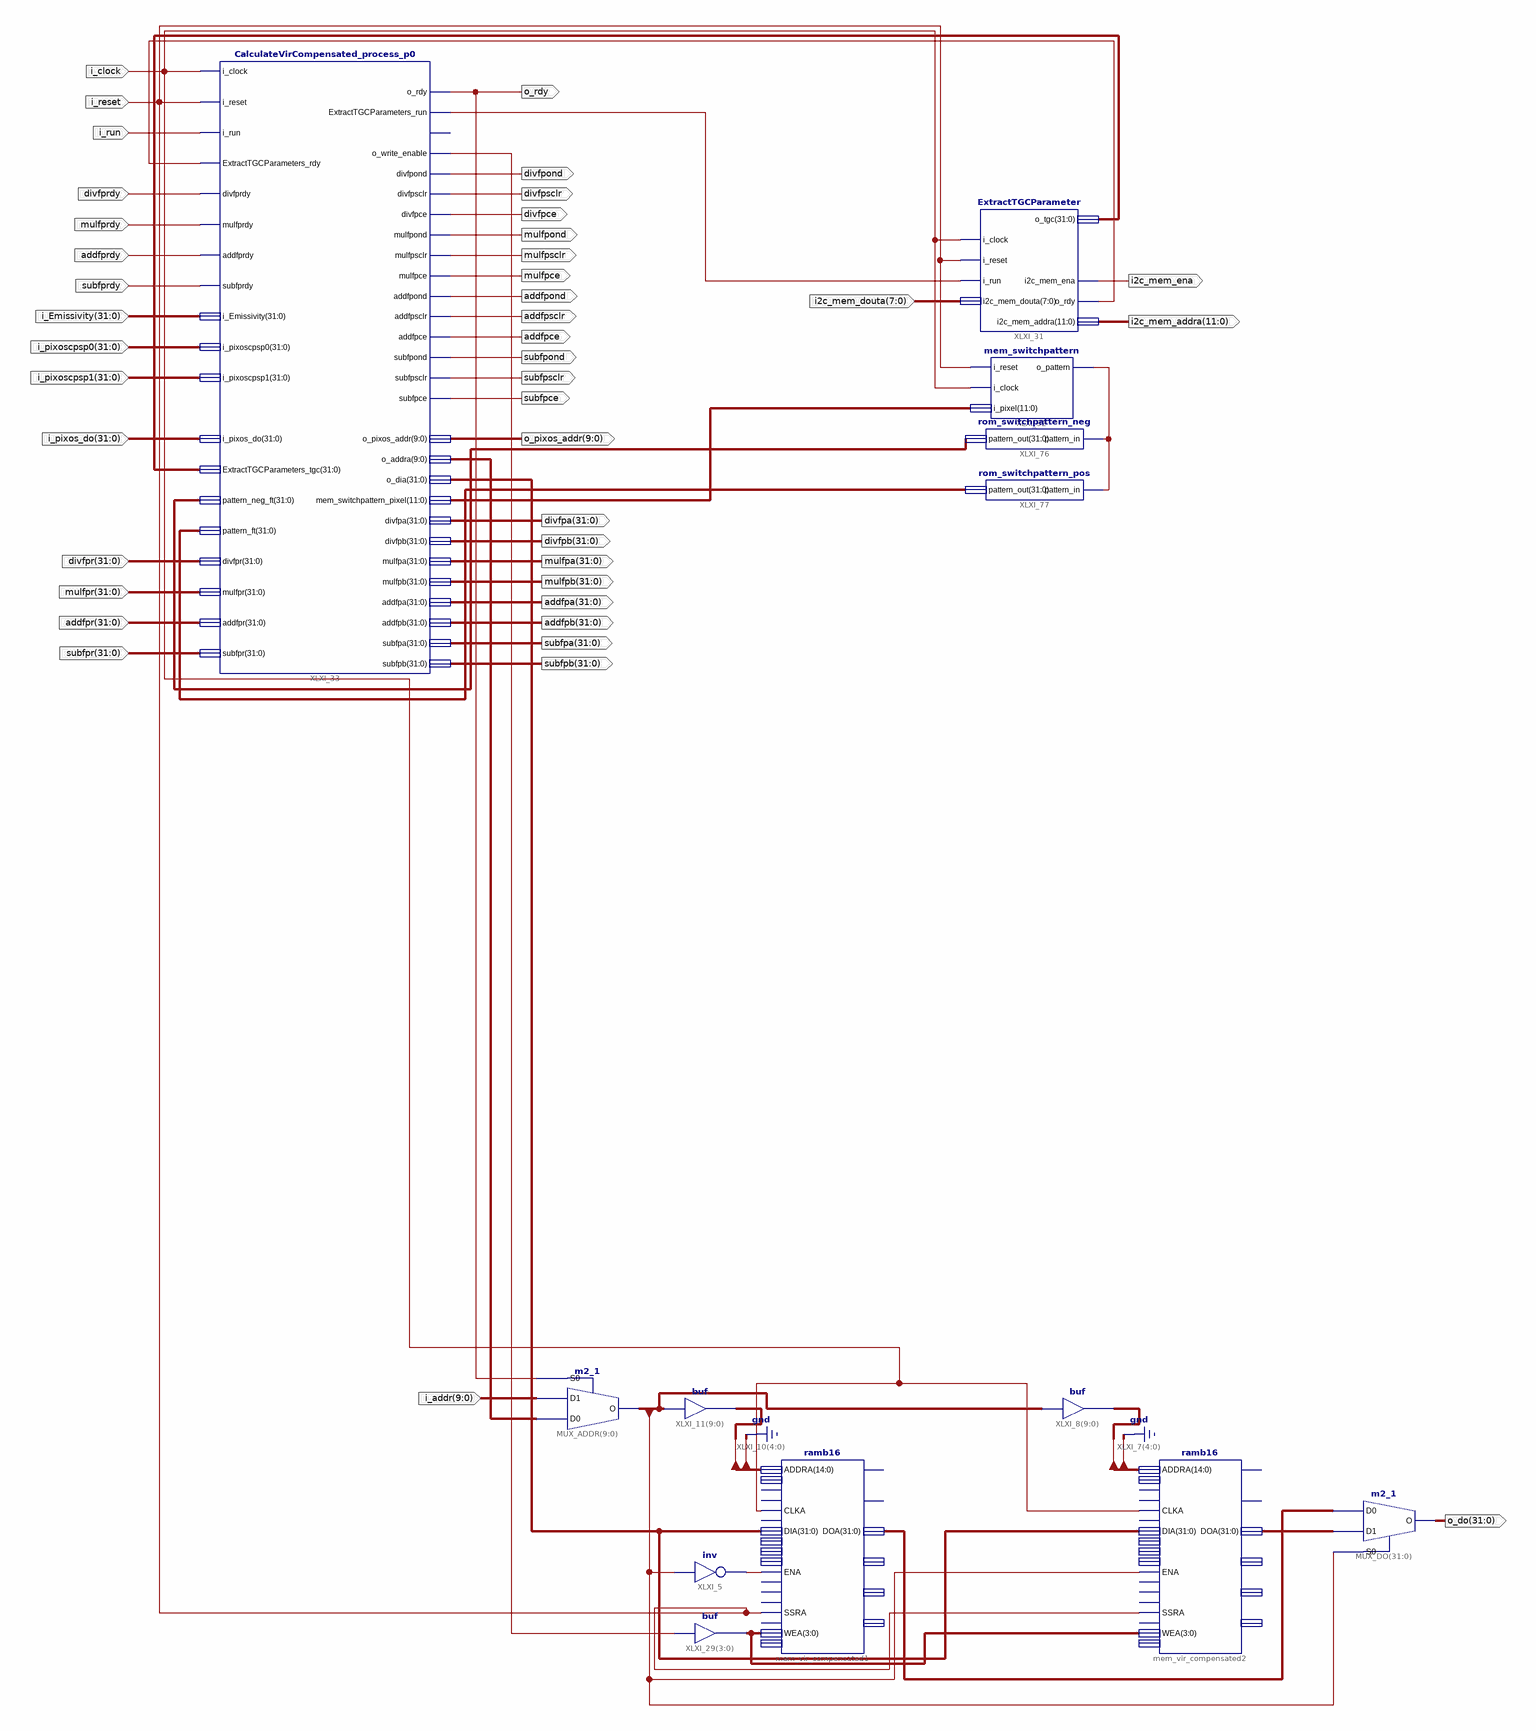
[diagram p0: schematic sheet 1]
// Xilinx ISE schematic CalculateVirCompensated.sch (virtex4) as structural Verilog: 13 symbols, 42 ports
module CalculateVirCompensated (
  input  [9:0] i_addr,
  input  i_clock,
  input  i_reset,
  input  [7:0] i2c_mem_douta,
  input  i_run,
  input  divfprdy,
  input  mulfprdy,
  input  addfprdy,
  input  subfprdy,
  input  [31:0] i_Emissivity,
  input  [31:0] i_pixoscpsp0,
  input  [31:0] i_pixoscpsp1,
  input  [31:0] i_pixos_do,
  input  [31:0] divfpr,
  input  [31:0] mulfpr,
  input  [31:0] addfpr,
  input  [31:0] subfpr,
  output [31:0] o_do,
  output i2c_mem_ena,
  output [11:0] i2c_mem_addra,
  output o_rdy,
  output divfpond,
  output divfpsclr,
  output divfpce,
  output mulfpond,
  output mulfpsclr,
  output mulfpce,
  output addfpond,
  output addfpsclr,
  output addfpce,
  output subfpond,
  output subfpsclr,
  output subfpce,
  output [9:0] o_pixos_addr,
  output [31:0] divfpa,
  output [31:0] divfpb,
  output [31:0] mulfpa,
  output [31:0] mulfpb,
  output [31:0] addfpa,
  output [31:0] addfpb,
  output [31:0] subfpa,
  output [31:0] subfpb
);

  wire XLXN_59, XLXN_212, XLXN_217, XLXN_218, XLXN_236;
  wire [3:0] XLXN_139;
  wire [9:0] mux_addr1, XLXN_241;
  wire [11:0] XLXN_213;
  wire [14:5] XLXN_44, XLXN_45;
  wire [31:0] XLXN_78, XLXN_79, XLXN_214, XLXN_215, XLXN_216, XLXN_239;

  CalculateVirCompensated_process_p0 XLXI_33 (
    .i_clock(i_clock), .i_reset(i_reset), .i_run(i_run), .ExtractTGCParameters_rdy(XLXN_217),
    .divfprdy(divfprdy), .mulfprdy(mulfprdy), .addfprdy(addfprdy), .subfprdy(subfprdy),
    .i_Emissivity(i_Emissivity), .i_pixoscpsp0(i_pixoscpsp0), .i_pixoscpsp1(i_pixoscpsp1),
    .i_pixos_do(i_pixos_do), .ExtractTGCParameters_tgc(XLXN_216), .pattern_neg_ft(XLXN_214),
    .pattern_ft(XLXN_215), .divfpr(divfpr), .mulfpr(mulfpr), .addfpr(addfpr), .subfpr(subfpr), .o_rdy(o_rdy),
    .ExtractTGCParameters_run(XLXN_218), .o_write_enable(XLXN_236), .divfpond(divfpond),
    .divfpsclr(divfpsclr), .divfpce(divfpce), .mulfpond(mulfpond), .mulfpsclr(mulfpsclr), .mulfpce(mulfpce),
    .addfpond(addfpond), .addfpsclr(addfpsclr), .addfpce(addfpce), .subfpond(subfpond),
    .subfpsclr(subfpsclr), .subfpce(subfpce), .o_pixos_addr(o_pixos_addr), .o_addra(XLXN_241),
    .o_dia(XLXN_239), .mem_switchpattern_pixel(XLXN_213), .divfpa(divfpa), .divfpb(divfpb), .mulfpa(mulfpa),
    .mulfpb(mulfpb), .addfpa(addfpa), .addfpb(addfpb), .subfpa(subfpa), .subfpb(subfpb));  // open: ExtractTGCParameters_mux
  ExtractTGCParameter XLXI_31 (
    .i_clock(i_clock), .i_reset(i_reset), .o_tgc(XLXN_216), .i_run(XLXN_218), .i2c_mem_douta(i2c_mem_douta),
    .i2c_mem_ena(i2c_mem_ena), .o_rdy(XLXN_217), .i2c_mem_addra(i2c_mem_addra));
  mem_switchpattern XLXI_32 (.i_reset(i_reset), .i_clock(i_clock), .i_pixel(XLXN_213), .o_pattern(XLXN_212));
  assign XLXN_45 = mux_addr1;  // buf XLXI_8[9..0], 10 bits wide
  assign XLXN_44 = mux_addr1;  // buf XLXI_11[9..0], 10 bits wide
  not XLXI_5 (XLXN_59, mux_addr1[9]);
  ramb16 #(.WRITE_WIDTH_B(36), .WRITE_WIDTH_A(36), .WRITE_MODE_B("READ_FIRST"), .WRITE_MODE_A("READ_FIRST"), .READ_WIDTH_B(36), .READ_WIDTH_A(36)) mem_vir_compensated1 (
    .ADDRA({XLXN_44, {5{1'b0}}}), .CLKA(i_clock), .DIA(XLXN_239), .ENA(XLXN_59), .SSRA(i_reset),
    .WEA(XLXN_139), .DOA(XLXN_79));  // open: ADDRB, CASCADEINA, CASCADEINB, CLKB, DIB, DIPA, DIPB, REGCEA, REGCEB, ENB, SSRB, WEB, CASCADEOUTA, CASCADEOUTB, DOB, DOPA, DOPB
  m2_1 MUX_DO[31:0] (.D0(XLXN_79), .D1(XLXN_78), .S0(mux_addr1[9]), .O(o_do));
  assign XLXN_139 = {4{XLXN_236}};  // buf XLXI_29[3..0], 4 bits wide
  m2_1 MUX_ADDR[9:0] (.D0(XLXN_241), .D1(i_addr), .S0(o_rdy), .O(mux_addr1));
  ramb16 #(.WRITE_WIDTH_B(36), .WRITE_WIDTH_A(36), .WRITE_MODE_B("READ_FIRST"), .WRITE_MODE_A("READ_FIRST"), .READ_WIDTH_B(36), .READ_WIDTH_A(36)) mem_vir_compensated2 (
    .ADDRA({XLXN_45, {5{1'b0}}}), .CLKA(i_clock), .DIA(XLXN_239), .ENA(mux_addr1[9]), .SSRA(i_reset),
    .WEA(XLXN_139), .DOA(XLXN_78));  // open: ADDRB, CASCADEINA, CASCADEINB, CLKB, DIB, DIPA, DIPB, REGCEA, REGCEB, ENB, SSRB, WEB, CASCADEOUTA, CASCADEOUTB, DOB, DOPA, DOPB
  rom_switchpattern_neg XLXI_76 (.pattern_in(XLXN_212), .pattern_out(XLXN_214));
  rom_switchpattern_pos XLXI_77 (.pattern_in(XLXN_212), .pattern_out(XLXN_215));
endmodule
